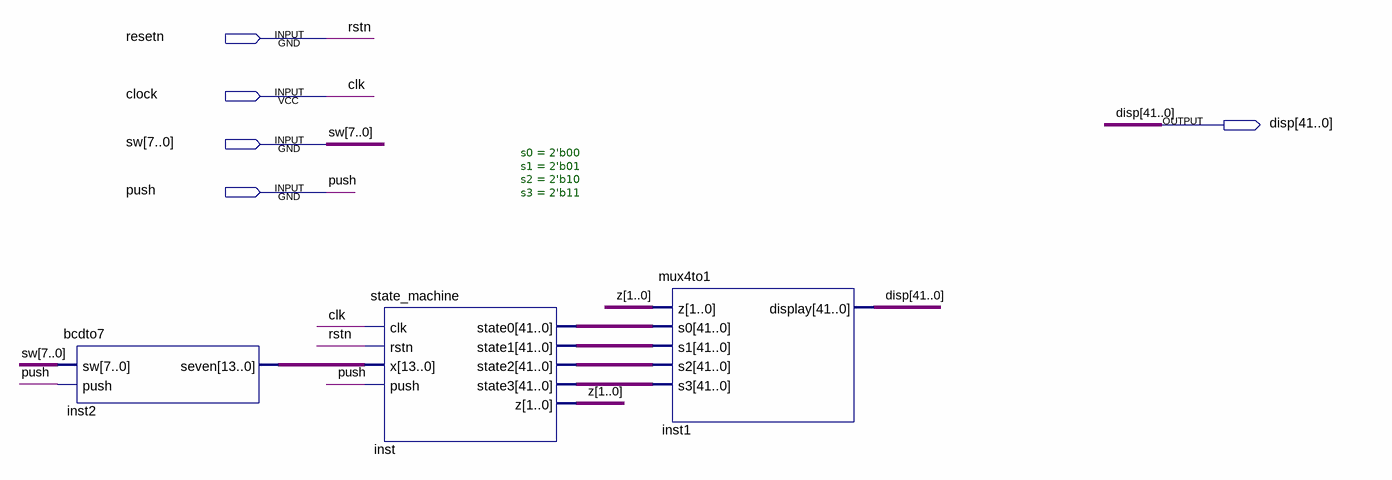
[diagram p0: schematic sheet]
// Quartus schematic Project.bdf as structural Verilog: 3 symbols, 5 pins
module Project (
  input  resetn,
  input  clock,
  input  [7:0] sw,
  input  push,
  output [41:0] disp
);

  wire [1:0] z;
  wire [13:0] inst2_seven;
  wire [41:0] inst_state0, inst_state1, inst_state2, inst_state3;

  bcdto7 inst2 (.sw(sw), .push(push), .seven(inst2_seven));
  state_machine #(.s0(2'b00), .s1(2'b01), .s2(2'b10), .s3(2'b11)) inst (
    .clk(clock), .rstn(resetn), .x(inst2_seven), .push(push), .state0(inst_state0), .state1(inst_state1),
    .state2(inst_state2), .state3(inst_state3), .z(z));
  mux4to1 inst1 (.z(z), .s0(inst_state0), .s1(inst_state1), .s2(inst_state2), .s3(inst_state3), .display(disp));

  // Other names for the same wires on the sheet: clk = clock; rstn = resetn
endmodule
